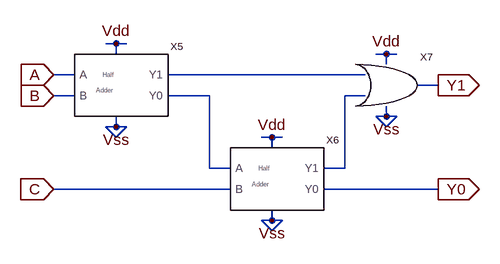
[diagram p0: schematic fulladder.asc]
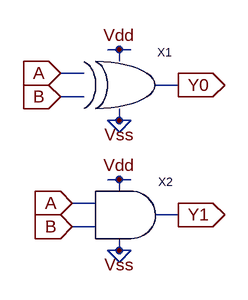
[diagram p1: sub-circuit halfadder.asc]
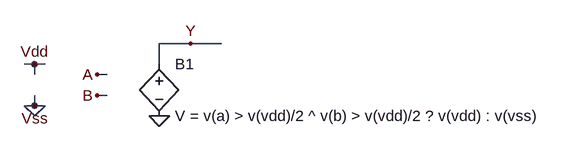
[diagram p2: sub-circuit xor.asc]
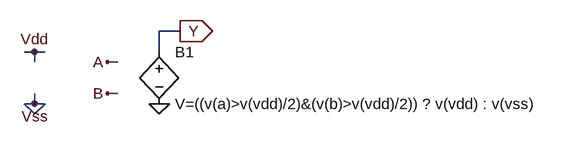
[diagram p3: sub-circuit and.asc]
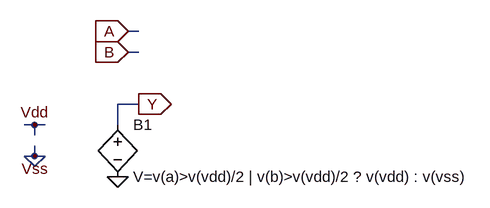
[diagram p4: sub-circuit or.asc]
fulladder.asc, the LTspice schematic file:
Version 4
SHEET 1 1124 956
WIRE 112 64 96 64
WIRE 128 64 112 64
WIRE 112 80 112 64
WIRE 528 80 512 80
WIRE 544 80 528 80
WIRE 528 96 528 80
WIRE 48 112 16 112
WIRE 496 112 192 112
WIRE 608 128 576 128
WIRE 48 144 16 144
WIRE 256 144 192 144
WIRE 496 144 464 144
WIRE 528 176 528 160
WIRE 528 176 512 176
WIRE 544 176 528 176
WIRE 112 192 112 176
WIRE 112 192 96 192
WIRE 128 192 112 192
WIRE 528 192 512 176
WIRE 528 192 544 176
WIRE 112 208 96 192
WIRE 112 208 128 192
WIRE 352 208 336 208
WIRE 368 208 352 208
WIRE 352 224 352 208
WIRE 256 256 256 144
WIRE 288 256 256 256
WIRE 464 256 464 144
WIRE 464 256 432 256
WIRE 288 288 16 288
WIRE 608 288 432 288
WIRE 352 336 352 320
WIRE 352 336 336 336
WIRE 368 336 352 336
WIRE 352 352 336 336
WIRE 352 352 368 336
FLAG 112 64 Vdd
FLAG 112 192 Vss
FLAG 352 208 Vdd
FLAG 352 336 Vss
FLAG 608 288 Y0
IOPIN 608 288 Out
FLAG 16 112 A
IOPIN 16 112 In
FLAG 16 144 B
IOPIN 16 144 In
FLAG 16 288 C
IOPIN 16 288 In
FLAG 528 80 Vdd
FLAG 528 176 Vss
FLAG 608 128 Y1
IOPIN 608 128 Out
SYMBOL HalfAdder 48 176 R0
SYMATTR InstName X5
SYMBOL HalfAdder 288 320 R0
SYMATTR InstName X6
SYMBOL or 496 128 R0
SYMATTR InstName X7

halfadder.asc, the sub-circuit schematic file:
Version 4
SHEET 1 880 680
WIRE 96 240 80 240
WIRE 112 240 96 240
WIRE 96 256 96 240
WIRE 48 272 16 272
WIRE 176 288 144 288
WIRE 48 304 16 304
WIRE 96 336 96 320
WIRE 96 336 80 336
WIRE 112 336 96 336
WIRE 96 352 80 336
WIRE 96 352 112 336
WIRE 96 416 80 416
WIRE 112 416 96 416
WIRE 96 432 96 416
WIRE 64 448 32 448
WIRE 176 464 144 464
WIRE 64 480 32 480
WIRE 96 512 96 496
WIRE 96 512 80 512
WIRE 112 512 96 512
WIRE 96 528 80 512
WIRE 96 528 112 512
FLAG 16 272 A
IOPIN 16 272 In
FLAG 16 304 B
IOPIN 16 304 In
FLAG 176 288 Y0
IOPIN 176 288 Out
FLAG 96 240 Vdd
FLAG 96 336 Vss
FLAG 96 416 Vdd
FLAG 96 512 Vss
FLAG 32 448 A
IOPIN 32 448 In
FLAG 32 480 B
IOPIN 32 480 In
FLAG 176 464 Y1
IOPIN 176 464 Out
SYMBOL xor 48 288 R0
SYMATTR InstName X1
SYMBOL and 64 464 R0
SYMATTR InstName X2

xor.asc, the sub-circuit schematic file:
Version 4
SHEET 1 1264 952
WIRE 592 448 544 448
WIRE 640 448 592 448
WIRE 352 480 336 480
WIRE 368 480 352 480
WIRE 544 480 544 448
WIRE 352 496 352 480
WIRE 464 496 448 496
WIRE 464 528 448 528
WIRE 352 544 352 528
WIRE 352 544 336 544
WIRE 368 544 352 544
WIRE 352 560 336 544
WIRE 352 560 368 544
FLAG 448 496 A
FLAG 448 528 B
FLAG 352 480 Vdd
FLAG 352 544 Vss
FLAG 544 560 0
FLAG 592 448 Y
SYMBOL bv 544 464 R0
SYMATTR InstName B1
SYMATTR Value V = v(a) > v(vdd)/2 ^ v(b) > v(vdd)/2 ? v(vdd) : v(vss)

and.asc, the sub-circuit schematic file:
Version 4
SHEET 1 1192 680
WIRE 560 80 528 80
WIRE 336 112 320 112
WIRE 352 112 336 112
WIRE 528 112 528 80
WIRE 336 128 336 112
WIRE 464 128 448 128
WIRE 464 176 448 176
WIRE 336 192 336 176
WIRE 336 192 320 192
WIRE 352 192 336 192
WIRE 336 208 320 192
WIRE 336 208 352 192
FLAG 448 128 A
FLAG 448 176 B
FLAG 336 112 Vdd
FLAG 560 80 Y
IOPIN 560 80 Out
FLAG 336 192 Vss
FLAG 528 192 0
SYMBOL bv 528 96 R0
SYMATTR InstName B1
SYMATTR Value V=((v(a)>v(vdd)/2)&(v(b)>v(vdd)/2)) ? v(vdd) : v(vss)

or.asc, the sub-circuit schematic file:
Version 4
SHEET 1 1284 680
WIRE 656 0 640 0
WIRE 656 32 640 32
WIRE 656 112 624 112
WIRE 496 144 480 144
WIRE 512 144 496 144
WIRE 624 144 624 112
WIRE 496 160 496 144
WIRE 496 192 496 176
WIRE 496 192 480 192
WIRE 512 192 496 192
WIRE 496 208 480 192
WIRE 496 208 512 192
FLAG 656 112 Y
IOPIN 656 112 Out
FLAG 624 224 0
FLAG 640 0 A
IOPIN 640 0 In
FLAG 640 32 B
IOPIN 640 32 In
FLAG 496 144 Vdd
FLAG 496 192 Vss
SYMBOL bv 624 128 R0
SYMATTR InstName B1
SYMATTR Value V=v(a)>v(vdd)/2 | v(b)>v(vdd)/2 ? v(vdd) : v(vss)

The netlist it stands for:
* fulladder.asc
XX5 A B N002 N001 Vdd Vss halfadder
XX6 N002 C Y0 N003 Vdd Vss halfadder
XX7 N001 N003 Y1 Vdd Vss or

* block symbol definitions
.subckt halfadder A B Y0 Y1 Vdd Vss
XX1 A B Y0 Vdd Vss xor
XX2 A B Y1 Vdd Vss and
.ends halfadder

.subckt xor A B Y Vdd Vss
B1 Y 0 V = v(a) > v(vdd)/2 ^ v(b) > v(vdd)/2 ? v(vdd) : v(vss)
.ends xor

.subckt and A B Y Vdd Vss
B1 Y 0 V=((v(a)>v(vdd)/2)&(v(b)>v(vdd)/2)) ? v(vdd) : v(vss)
.ends and

.subckt or A B Y Vdd Vss
B1 Y 0 V=v(a)>v(vdd)/2 | v(b)>v(vdd)/2 ? v(vdd) : v(vss)
.ends or

.backanno
.end